# Altium schematic sheet KookWekker.SchDoc: Kookwekker
size A4; Author: Fabian Eppens; DrawnBy: Fabian Eppens; Revision: 1.0; SheetNumber: 1; SheetTotal: 3
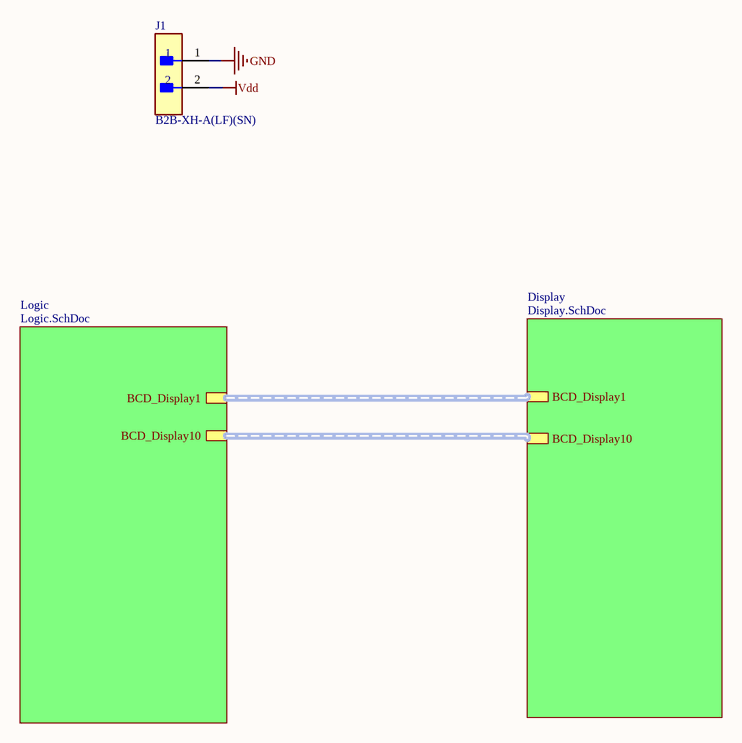
[diagram p0: KookWekker.SchDoc]

## Parts
J1  B2B-XH-A(LF)(SN)  [FP-B2B-XH-A_LF_SN-MFG]

## Sub-sheets
Display = Display.SchDoc: BCD_Display1 (harness BCD1), BCD_Display10 (harness BCD10)
Logic = Logic.SchDoc: BCD_Display1 (harness BCD1), BCD_Display10 (harness BCD10)

## Nets
GND: J1.1
Vdd: J1.2

## Buses and harness runs
harness sheet Display/BCD_Display1 = sheet Logic/BCD_Display1
harness sheet Display/BCD_Display10 = sheet Logic/BCD_Display10

## Notes on the sheet
- Size:
- Date:
- Drawn by:
- Revision:
- Hogeschool Windesheim
- Campus 2-6
- Postbus 10090
- A4
- Sheet
- of
- 8000GB, Zwolle

## Library data of the parts
J1 = CMP-2000-05888-3: CONN HEADER VERT 2POS 2.5MM; Current Rating: 3A; Voltage Rating: 250V; Number of Contacts: 2; Contact Resistance: 20mR; Wire/Cable Gauge: 22AWG; Insulation Resistance: 1GR; Connector Type: Male Pin; Packaging: Bulk; Contact Material: Brass; Lead Free: Lead Free; Orientation: Straight; Contact Plating: Tin; Max Current Rating: 3A; Termination: Solder; Fastening Type: Detent; Depth: 5.75mm; Housing Material: Polyamide; REACH SVHC: No SVHC; Series: XH; Voltage Rating (AC): 250V; Number of Positions: 2; Color: Natural; Contact Type: Male Pin; Max Voltage Rating (DC): 250V; Pitch: 2.5mm; Lead Pitch: 2.5mm; Mount: Through Hole; Max Operating Temperature: 85°C; Length: 7.4mm; Max Voltage Rating (AC): 250V; Min Operating Temperature: -25°C; Number of Rows: 1; Housing Color: White